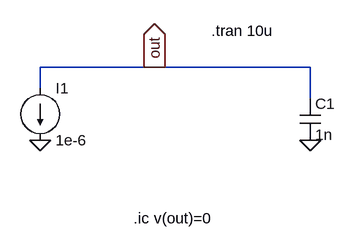
[diagram p0: schematic question12.asc]
question12.asc, the LTspice schematic file:
Version 4
SHEET 1 880 680
WIRE 208 80 32 80
WIRE 448 80 208 80
WIRE 32 112 32 80
WIRE 448 128 448 80
FLAG 32 192 0
FLAG 448 192 0
FLAG 208 80 out
IOPIN 208 80 Out
SYMBOL cap 432 128 R0
SYMATTR InstName C1
SYMATTR Value 1n
SYMBOL current 32 112 R0
WINDOW 123 0 0 Left 0
WINDOW 39 0 0 Left 0
SYMATTR InstName I1
SYMATTR Value 1e-6
TEXT 296 24 Left 2 !.tran 10u
TEXT 176 312 Left 2 !.ic v(out)=0

The netlist it stands for:
* question12.asc
C1 out 0 1n
I1 out 0 1e-6
.tran 10u
.ic v(out)=0
.backanno
.end